# Altium schematic sheet ESC1.SchDoc
size A4; DocumentNumber: 1; SheetNumber: 1; SheetTotal: 2
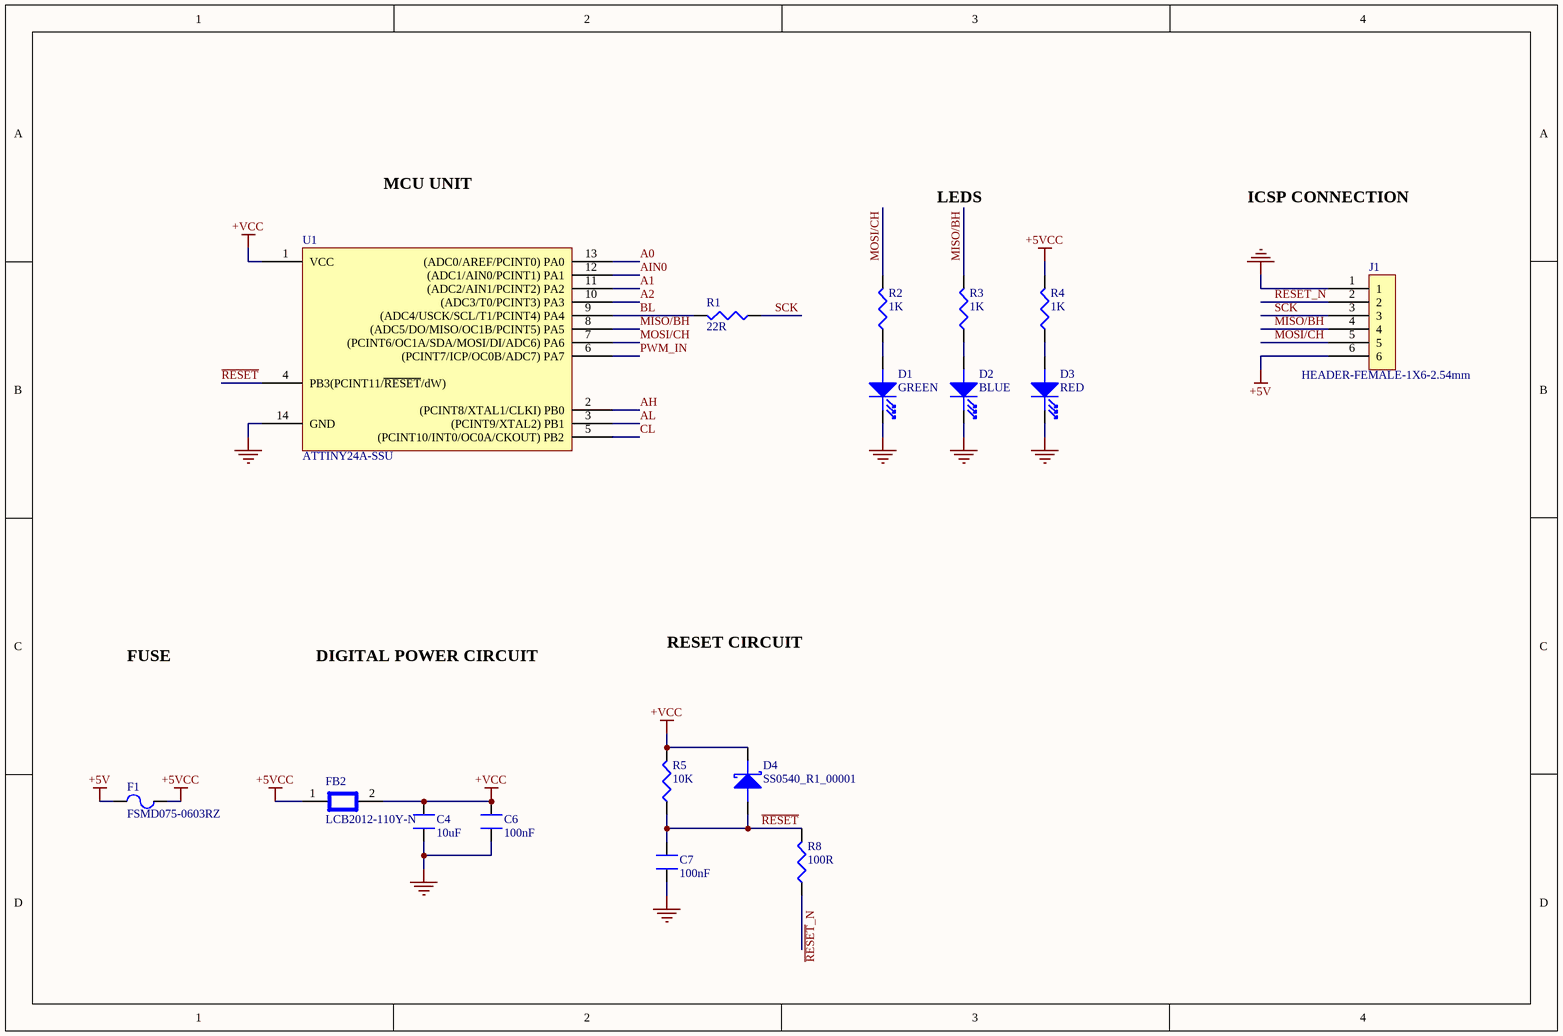
[diagram p0: ESC1.SchDoc]

## Parts
C4  10uF  [Z0603]
C6  100nF  [Z0603]
C7  100nF  [Z0603]
D1  GREEN  [LED-0603]
D2  BLUE  [LED-0603]
D3  RED  [LED-0603]
D4  SS0540_R1_00001  [SOD-123]
F1  FSMD075-0603RZ  [F-0603]
FB2  LCB2012-110Y-N  [C0805]
J1  HEADER-FEMALE-1X6-2.54mm  [FEMALE-1X6-2.54mm]
R1  22R  [Z0603]
R2  1K  [Z0603]
R3  1K  [Z0603]
R4  1K  [Z0603]
R5  10K  [Z0603]
R8  100R  [Z0603]
U1  ATTINY24A-SSU  [SOIC14]

## Nets
+5V: F1.1 J1.6
+5VCC: F1.2 FB2.1 R4.2
+VCC: C4.2 C6.2 D4.1(Cathode) FB2.2 R5.2 U1.1(VCC)
GND: C4.1 C6.1 C7.1 D1.1(Cathode) D2.1(Cathode) D3.1(Cathode) J1.1 U1.14(GND)
A0: U1.13((ADC0/AREF/PCINT0)_PA0)
A1: U1.11((ADC2/AIN1/PCINT2)_PA2)
A2: U1.10((ADC3/T0/PCINT3)_PA3)
AH: U1.2((PCINT8/XTAL1/CLKI)_PB0)
AIN0: U1.12((ADC1/AIN0/PCINT1)_PA1)
AL: U1.3((PCINT9/XTAL2)_PB1)
BL: R1.2 U1.9((ADC4/USCK/SCL/T1/PCINT4)_PA4)
CL: U1.5((PCINT10/INT0/OC0A/CKOUT)_PB2)
MISO/BH: J1.4 R3.2 U1.8((ADC5/DO/MISO/OC1B/PCINT5)_PA5)
MOSI/CH: J1.5 R2.2 U1.7((PCINT6/OC1A/SDA/MOSI/DI/ADC6)_PA6)
PWM_IN: U1.6((PCINT7/ICP/OC0B/ADC7)_PA7)
~{RESET}: C7.2 D4.2(Anode) R5.1 R8.2 U1.4(PB3(PCINT11/~{RESET}/dW))
~{RESET}_N: J1.2 R8.1
SCK: J1.3 R1.1
NetD1_2: D1.2(Anode) R2.1
NetD2_2: D2.2(Anode) R3.1
NetD3_2: D3.2(Anode) R4.1

## Notes on the sheet
- MCU UNIT
- LEDS
- ICSP CONNECTION
- RESET CIRCUIT
- FUSE
- DIGITAL POWER CIRCUIT

## Library data of the parts
C4 = CL10A106KP8NNNC: Cap Ceramic 10uF 10V X5R 10% Pad SMD 0603 85C T/R; Manufacturer: Samsung; OZDISAN_PRICE: 0.60 TRY; Supplier 1: Future Electronics; Manufacturer Part Number: CL10A106KP8NNNC; RoHS: Yes; Category: Ceramic Capacitors; Stock 1: 202000; Pricing 1: 4000=0,03170, 8000=0,02840, 12000=0,02830, 20000=0,02810, 40000=0,02790 (USD); Mount: Surface Mount; Case/Package: 0603; Case Code (Metric): 1608; Case Code (Imperial): 0603; Material: Ceramic; Contact Plating: Tin; Min Operating Temperature: -55°C; Max Operating Temperature: 85°C; Capacitance: 10uF; Tolerance: 10%; Dielectric: X5R; Package Quantity: 1; Packaging: Tape and Reel; Voltage Rating: 10V; Voltage Rating (DC): 10V; Series: CL; Construction: Flat; Length: 1.6mm; Width: 0.031inch; Height: 0.8mm; Thickness: 0.035inch; Depth: 0.8mm; Radiation Hardening: No; Lead Free: Lead Free; RoHS Compliant: Yes; Supplier Part Number 1: 5232459; ComponentLink4Description: OZDISAN_LINK; ComponentLink4URL: https://ozdisan.com/Product/Detail/350863/CL10A106KP8NNNC
C6 C7 = CL10B104KB8NNNC: Multi Layer Ceramic Capacitor (MLCC) / Cap Ceramic 0.1uF 50V X7R 10% Pad SMD 0603 125¡ãC T/R; Manufacturer: Samsung; OZDISAN_PRICE: 0.05 TRY; Supplier 1: RSComponents; Manufacturer Part Number: CL10B104KB8NNNC; RoHS: Yes; Category: Ceramic Capacitors; Stock 1: 17024000; Pricing 1: 4000=0,00800, 8000=0,00800, 16000=0,00800, 24000=0,00700, 40000=0,00600, 4000=0,00600, 8000=0,00600, 16000=0,00600, 24000=0,00500, 40000=0,00400 (USD); Mount: Surface Mount; Case/Package: 0603; Case Code (Metric): 1608; Case Code (Imperial): 0603; Material: Ceramic; Contact Plating: Tin; Min Operating Temperature: -55°C; Max Operating Temperature: 125°C; Capacitance: 100nF; Dielectric: X7R; Tolerance: 10%; Voltage Rating: 50V; Package Quantity: 1; Packaging: Tape and Reel; Voltage: 50V; Voltage Rating (DC): 50V; Series: CL; Construction: Flat; Length: 1.6mm; Width: 0.031inch; Height: 0.8mm; Depth: 0.8mm; Thickness: 0.035inch; Radiation Hardening: No; Lead Free: Lead Free; RoHS Compliant: Yes; Supplier Part Number 1: 7665443; ComponentLink4Description: OZDISAN_LINK; ComponentLink4URL: https://ozdisan.com/pasif-komponentler/kondansatorler/smt-smd-ve-mlcc-kondansatorler/CL10B104KB8NNNC
D1 = HL-PST-1608U51GC: OZDISAN_PRICE: 0.22 TRY; Case-Package: 0603; ComponentLink1Description: OZDISAN_LINK; ComponentLink1URL: https://ozdisan.com/Product/Detail/471660/HL-PST-1608U51GC
D2 = 27-21/B7C-ZR1S1N/3C: OZDISAN_PRICE: 1,46 TRY; ComponentLink1Description: OZDISAN_LINK; ComponentLink1URL: https://ozdisan.com/led-ve-aydinlatma-cozumleri/led-komponentler/sinyal-ledler-renkli/27-21B7C-ZR1S1N3C; Case-Package: 0603
D3 = LTST-C190KRKT: 0603 red led alingap 631nm-639nm water clear 18-180mcd 130d; Manufacturer: Vishay Lite-On; Lens Color: Colorless; Luminous Intensity: 54mcd; Forward Current: 30mA; Viewing Angle: 130°; Forward Voltage: 2.4V; Lens Style: Diffused,Colorless,Clear,Rectangular; Power Rating: 75mW; Dominant Wavelength: 631nm; Test Current: 20mA; Number of Elements: 1; Wavelength: 639nm; Reverse Voltage: 5V; OZDISAN_PRICE: 0.38 TRY; Supplier 1: Digi-Key; Manufacturer Part Number: LTST-C190KRKT; RoHS: Yes; Category: LEDs; Stock 1: 874288; Pricing 1: 1=0,24000, 10=0,13200, 100=0,06110, 500=0,05640, 1000=0,04418, 2000=0,04324 (USD); Mount: Surface Mount; Case/Package: 0603; Number of Pins: 2; Color: Red; Case Code (Metric): 1608; Case Code (Imperial): 0603; Min Operating Temperature: -55°C; Max Operating Temperature: 85°C; Packaging: Tape and Reel; Package Quantity: 1; Illumination Color: Red; Lens Transparency: Clear; Power Dissipation: 75mW; Number of LEDs: 1; Length: 1.6mm; Width: 0.8mm; Height: 0.8mm; Depth: 0.8mm; Radiation Hardening: No; Lead Free: Lead Free; RoHS Compliant: Yes; Supplier Part Number 1: 160-1436-1-ND; ComponentLink10Description: OZDISAN_LINK; ComponentLink10URL: https://ozdisan.com/led-ve-aydinlatma-cozumleri/led-komponentler/sinyal-ledler-renkli/LTST-C190KRKT
D4 = SS0540_R1_00001: Diode Schottky 40V 0.5A 2-Pin SOD-123 T/R; Manufacturer: Pan Jit; Peak Non-Repetitive Surge Current: 5.5A; Element Configuration: Single; OZDISAN_PRICE: 0.55 TRY; Supplier 1: Digi-Key; Manufacturer Part Number: SS0540_R1_00001; RoHS: Yes; Category: Rectifier Diodes; Stock 1: 6025; Pricing 1: 1=0,29000, 10=0,23400, 100=0,12410, 500=0,08168, 1000=0,05554 (USD); Mount: Surface Mount; Min Operating Temperature: -55°C; Max Operating Temperature: 125°C; Max Repetitive Reverse Voltage (Vrrm): 40V; Radiation Hardening: No; RoHS Compliant: Yes; Supplier Part Number 1: 3757-SS0540_R1_00001CT-ND; ComponentLink3Description: OZDISAN_LINK; ComponentLink3URL: https://ozdisan.com/guc-yari-iletkenleri/diyotlar-modul-diyotlar-ve-dogrultucular/schottky-diyotlar/SS0540R100001
F1 = FSMD075-0603RZ: OZDISAN_PRICE: 3.16 TRY; Current Rating: 0.75; Max Voltage: 6V; Case-Package: 0603; ComponentLink1Description: OZDISAN_LINK; ComponentLink1URL: https://ozdisan.com/guc-yari-iletkenleri/devre-koruyucu-komponentler/ptc-sigortalar/FSMD075-0603RZ
FB2 = LCB2012-110Y-N: OZDISAN_PRICE: 0,22 TRY; ComponentLink1Description: OZDISAN_LINK; ComponentLink1URL: https://ozdisan.com/pasif-komponentler/induktorler/bead-feritler/LCB2012-110Y-N; Case-Package: 0603
J1 = PPPC061LFBN-RC: CONN HDR 6POS 0.1 GOLD PCB; Manufacturer: Sullins; Connector Type: Header,Socket; Number of Positions: 6; Pitch: 0.1inch; Supplier 1: Digi-Key; Manufacturer Part Number: PPPC061LFBN-RC; RoHS: Yes; Category: Connectors; Stock 1: 33601; Pricing 1: 1=0,53000, 10=0,46500, 80=0,38300, 440=0,33300, 1000=0,27472, 5000=0,24142, 10000=0,24050 (USD); Mount: Through Hole; Color: Black; Contact Plating: Gold; Housing Material: Plastic; Contact Material: Bronze; Package Quantity: 1000; Number of Rows: 1; Packaging: Bulk; Termination: Solder; Length: 15.7mm; Width: 2.5mm; Height: 8.5mm; Lead Free: Lead Free; ComponentLink1URL: https://media.digikey.com/pdf/Data%20Sheets/Sullins%20PDFs/Female_Headers.100_DS.pdf?src-supplier=Digi-Key; ComponentLink1Description: https://media.digikey.com/pdf/Data%20Sheets/Sullins%20PDFs/Female_Headers.100_DS.pdf?src-supplier=Digi-Key; Supplier Part Number 1: S7039-ND
R1 = MC0603SAF220JT5E: MULTICOMP         MC0603SAF220JT5E            RESISTOR, THICK FILM, 22OHM, 100mW, 1%; Voltage Rating: 75V; Temperature Coefficient: 100ppm/°C; OZDISAN_PRICE: 0.02 TRY; Supplier 1: Newark; Manufacturer: Multicomp; Manufacturer Part Number: MC0603SAF220JT5E; RoHS: Yes; Category: Resistors; Case/Package: 0603; Number of Pins: 2; Case Code (Metric): 1608; Case Code (Imperial): 0603; Packaging: Cut Tape; Resistance: 22R; Resistor Type: Thick Film; Power Rating: 100mW; Tolerance: 1%; Voltage Rating (DC): 75V; Resistance Tolerance: 1%; RoHS Compliant: Yes; REACH SVHC: Unknown; Supplier Part Number 1: 79M5934; ComponentLink2Description: OZDISAN_LINK; ComponentLink2URL: https://ozdisan.com/pasif-komponentler/direncler/smt-smd-ve-cip-direncler/0603SAF220JT5E
R2-R4 = MC0603SAF1001T5E: MULTICOMP - MC0603SAF1001T5E - THICK FILM RESISTOR, 1KOHM, 100mW, 1%; Resistance: 1kR; Voltage Rating: 75V; Temperature Coefficient: 100ppm/°C; OZDISAN_PRICE: 0.02 TRY; Supplier 1: Farnell; Manufacturer: Multicomp; Manufacturer Part Number: MC0603SAF1001T5E; RoHS: Yes; Category: Resistors; Stock 1: 340; Pricing 1: 1=0,00890, 10=0,00810, 100=0,00730, 1000=0,00390 (GBP); Case/Package: 0603; Case Code (Metric): 1608; Case Code (Imperial): 0603; Tolerance: 1%; Power Rating: 100mW; Resistor Type: Thick Film; Packaging: Cut Tape; Voltage Rating (DC): 75V; Resistance Tolerance: 1%; RoHS Compliant: Yes; REACH SVHC: Unknown; Supplier Part Number 1: 1632391; ComponentLink2Description: OZDISAN_LINK; ComponentLink2URL: https://ozdisan.com/pasif-komponentler/direncler/smt-smd-ve-cip-direncler/0603SAF1001T5E
R5 = CQ03SAF1002T5E: OZDISAN_PRICE: 0.03 TRY; ComponentLink1Description: OZDISAN_LINK; ComponentLink1URL: https://ozdisan.com/pasif-komponentler/direncler/smt-smd-ve-cip-direncler/CQ03SAF1002T5E; Case-Package: 0603
R8 = 0603SAJ0101T5E: OZDISAN_PRICE: 0.02 TRY; ComponentLink1Description: OZDISAN_LINK; ComponentLink1URL: https://ozdisan.com/pasif-komponentler/direncler/smt-smd-ve-cip-direncler/0603SAJ0101T5E; Case-Package: 0603
U1 = ATTINY24A-SSUR: MCU 8-bit ATtiny AVR RISC 2KB Flash 2.5V/3.3V/5V 14-Pin SOIC W T/R; Manufacturer: Microchip / Atmel; Number of I/Os: 12; Frequency: 20MHz; Oscillator Type: Internal; Peripherals: Brown-out Detect/Reset,POR,PWM,WDT,Temp Sensor; Interface: SPI; Number of Timers/Counters: 2; RAM Size: 128B; Max Supply Voltage: 5.5V; Min Supply Voltage: 1.8V; Data Bus Width: 8b; Watchdog Timer: Yes; OZDISAN_PRICE: 35,93; Supplier 1: Future Electronics; Manufacturer Part Number: ATTINY24A-SSUR; RoHS: Yes; Category: Microcontrollers; Mount: Surface Mount; Case/Package: SOIC; Number of Pins: 14; Contact Plating: Tin,Matte; Min Operating Temperature: -40°C; Max Operating Temperature: 85°C; Packaging: Tape and Reel; Memory Type: FLASH; Memory Size: 2KB; Core Architecture: AVR; Package Quantity: 1; Number of Programmable I/O: 12; Max Frequency: 20MHz; Series: AVR® ATtiny; Radiation Hardening: No; REACH SVHC: No SVHC; Lead Free: Lead Free; ComponentLink1URL: https://ozdisan.com/entegre-devreler-ics/embedded-entegreler/mikroislemciler/ATTINY24A-SSU; ComponentLink1Description: OZDISAN_LINK; Supplier Part Number 1: 6049728